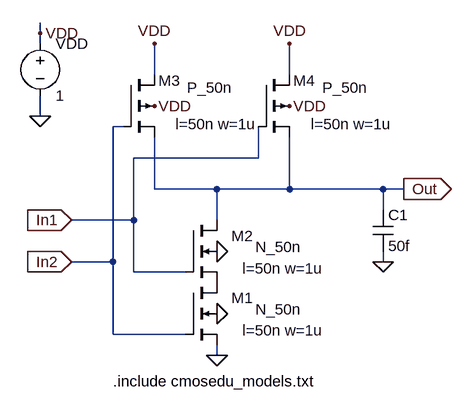
[diagram p0: schematic NAND2.asc]
NAND2.asc, the LTspice schematic file:
Version 4
SHEET 1 1136 680
WIRE 320 -512 320 -528
WIRE 320 -496 320 -512
WIRE 496 -448 496 -496
WIRE 704 -448 704 -496
WIRE 320 -384 320 -416
WIRE 448 -368 432 -368
WIRE 656 -320 656 -368
WIRE 656 -320 464 -320
WIRE 496 -272 496 -352
WIRE 592 -272 496 -272
WIRE 704 -272 704 -352
WIRE 704 -272 592 -272
WIRE 848 -272 704 -272
WIRE 880 -272 848 -272
WIRE 848 -240 848 -272
WIRE 464 -224 464 -320
WIRE 464 -224 368 -224
WIRE 592 -224 592 -272
WIRE 432 -160 368 -160
WIRE 432 -160 432 -368
WIRE 848 -160 848 -176
WIRE 464 -144 464 -224
WIRE 544 -144 464 -144
WIRE 432 -48 432 -160
WIRE 544 -48 432 -48
WIRE 592 -16 592 -32
FLAG 592 -176 0
FLAG 320 -384 0
FLAG 320 -512 VDD
FLAG 496 -400 VDD
FLAG 592 -16 0
FLAG 496 -496 VDD
FLAG 704 -400 VDD
FLAG 704 -496 VDD
FLAG 592 -80 0
FLAG 848 -160 0
FLAG 880 -272 Out
IOPIN 880 -272 Out
FLAG 368 -224 In1
IOPIN 368 -224 In
FLAG 368 -160 In2
IOPIN 368 -160 In
SYMBOL voltage 320 -512 R0
WINDOW 123 0 0 Left 2
WINDOW 39 0 0 Left 2
SYMATTR InstName VDD
SYMATTR Value 1
SYMBOL pmos4 448 -448 R0
WINDOW 0 88 9 Right 2
WINDOW 3 168 20 Right 2
WINDOW 123 206 76 Right 2
SYMATTR InstName M3
SYMATTR Value P_50n
SYMATTR Value2 l=50n w=1u
SYMBOL nmos4 544 -128 R0
WINDOW 0 104 24 Right 2
WINDOW 3 179 41 Right 2
WINDOW 123 213 74 Right 2
SYMATTR InstName M1
SYMATTR Value N_50n
SYMATTR Value2 l=50n w=1u
SYMBOL nmos4 544 -224 R0
WINDOW 0 104 24 Right 2
WINDOW 3 179 41 Right 2
WINDOW 123 213 74 Right 2
SYMATTR InstName M2
SYMATTR Value N_50n
SYMATTR Value2 l=50n w=1u
SYMBOL pmos4 656 -448 R0
WINDOW 0 88 9 Right 2
WINDOW 3 168 20 Right 2
WINDOW 123 206 76 Right 2
SYMATTR InstName M4
SYMATTR Value P_50n
SYMATTR Value2 l=50n w=1u
SYMBOL cap 832 -240 R0
SYMATTR InstName C1
SYMATTR Value 50f
TEXT 432 24 Left 2 !.include cmosedu_models.txt

The netlist it stands for:
* NAND2.asc
VDD VDD 0 1
M3 VDD In2 Out VDD P_50n l=50n w=1u
M1 P001 In2 0 0 N_50n l=50n w=1u
M2 Out In1 P001 0 N_50n l=50n w=1u
M4 VDD In1 Out VDD P_50n l=50n w=1u
C1 Out 0 50f
.model NMOS NMOS
.model PMOS PMOS
.lib standard.mos
.include cmosedu_models.txt
.backanno
.end